# EAGLE design ItsyBitsy_Expander_v1.1 (EAGLE 9.2.2)
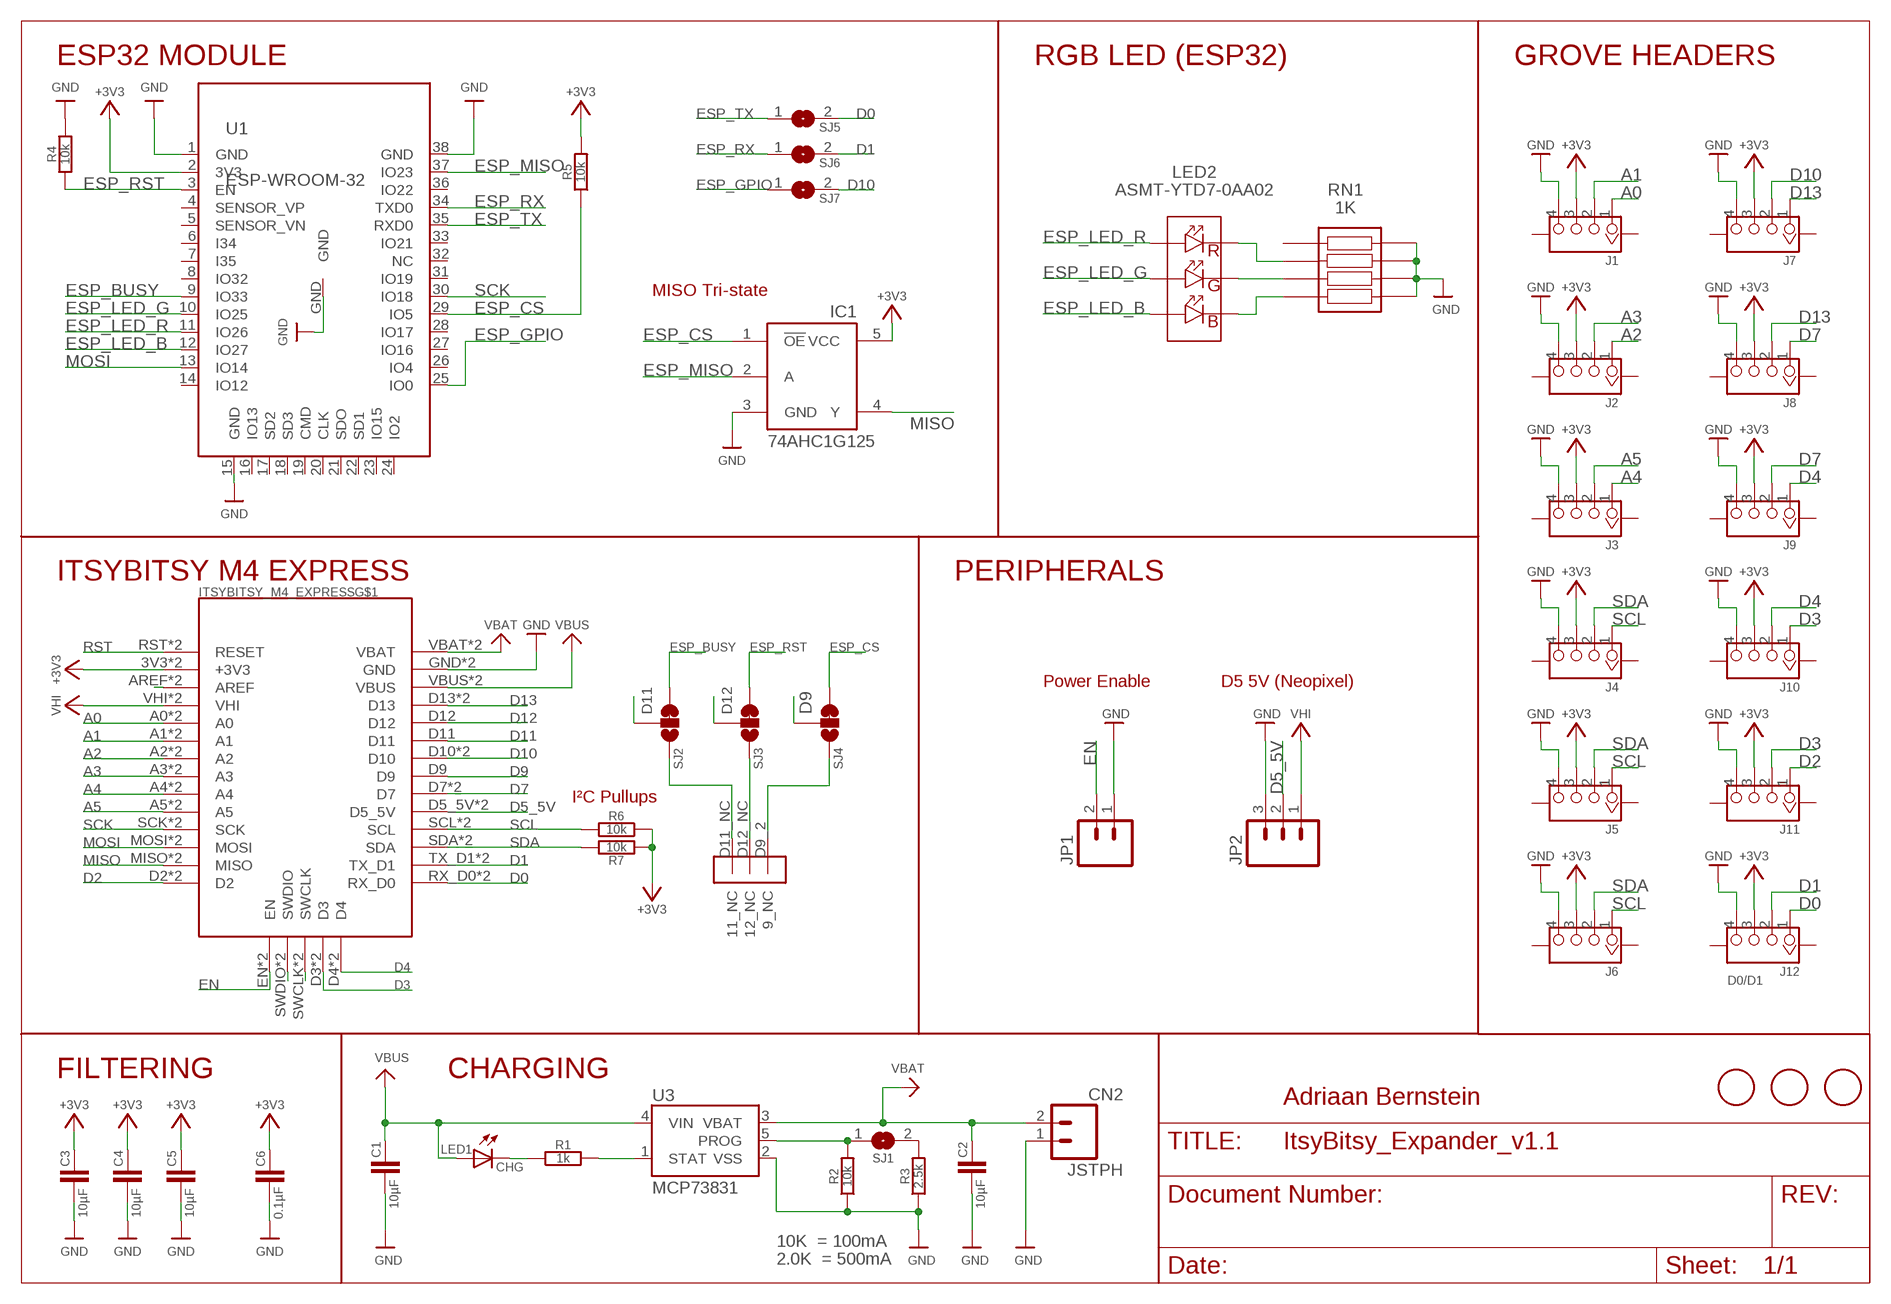
[diagram p0: schematic, sheet 1]

## Parts
C1  10µF  C-EUC0805  [C0805]
C2  10µF  C-EUC0805  [C0805]
C3  10µF  C-EUC0805  [C0805]
C4  10µF  C-EUC0805  [C0805]
C5  10µF  C-EUC0805  [C0805]
C6  0.1µF  C-EUC0603  [C0603]
CN2  JSTPH  M02-JST-2MM-SMT  [JST-2-SMD]
IC1  74AHC1G125  [SOT23-5L]
ITSYBITSY_M4_EXPRESS  ITSYBITSY_M4_NC  [ITSYBITSY_M4_MIXED_DOUBLEHEADERS_ALL_NC]
J1  H4P-SMD-2.0  GROVE-CONNECTOR-4PINHW4-PTH-2.0  [HW4-PTH-2.0]
J2  H4P-SMD-2.0  GROVE-CONNECTOR-4PINHW4-PTH-2.0  [HW4-PTH-2.0]
J3  H4P-SMD-2.0  GROVE-CONNECTOR-4PINHW4-PTH-2.0  [HW4-PTH-2.0]
J4  H4P-SMD-2.0  GROVE-CONNECTOR-4PINHW4-PTH-2.0  [HW4-PTH-2.0]
J5  H4P-SMD-2.0  GROVE-CONNECTOR-4PINHW4-PTH-2.0  [HW4-PTH-2.0]
J6  H4P-SMD-2.0  GROVE-CONNECTOR-4PINHW4-PTH-2.0  [HW4-PTH-2.0]
J7  H4P-SMD-2.0  GROVE-CONNECTOR-4PINHW4-PTH-2.0  [HW4-PTH-2.0]
J8  H4P-SMD-2.0  GROVE-CONNECTOR-4PINHW4-PTH-2.0  [HW4-PTH-2.0]
J9  H4P-SMD-2.0  GROVE-CONNECTOR-4PINHW4-PTH-2.0  [HW4-PTH-2.0]
J10  H4P-SMD-2.0  GROVE-CONNECTOR-4PINHW4-PTH-2.0  [HW4-PTH-2.0]
J11  H4P-SMD-2.0  GROVE-CONNECTOR-4PINHW4-PTH-2.0  [HW4-PTH-2.0]
J12  H4P-SMD-2.0  GROVE-CONNECTOR-4PINHW4-PTH-2.0  [HW4-PTH-2.0]
JP1  M02PTH  [1X02]
JP2  M03PTH  [1X03]
LED1  CHG  LEDCHIP-LED0603  [CHIP-LED0603]
LED2  ASMT-YTD7-0AA02  [ASMTYTD70AA02]
R1  1k  R-EU_R0603  [R0603]
R2  10k  R-EU_R0603  [R0603]
R3  2.5k  R-EU_R0603  [R0603]
R4  10k  R-EU_R0603  [R0603]
R5  10k  R-EU_R0603  [R0603]
R6  10k  R-EU_R0603  [R0603]
R7  10k  R-EU_R0603  [R0603]
RN1  1K  CAY16-221J4AS  [CAY1647R0F4LF]
SJ1  SJ  [SJ]
SJ5  SJ  [SJ]
SJ6  SJ  [SJ]
SJ7  SJ  [SJ]
SJ_D11  SJ2  SJ_2WAY_CLOSED  [SJ_2WAY_CLOSED]
SJ_D12  SJ3  SJ_2WAY_CLOSED  [SJ_2WAY_CLOSED]
SJ_D13  SJ4  SJ_2WAY_CLOSED  [SJ_2WAY_CLOSED]
U1  ESP-WROOM-32  [ESP-WROOM-32]
U3  MCP73831  [SOT23-5]
U$23  FIDUCIAL  [FIDUCIAL_1MM]
U$35  FIDUCIAL  [FIDUCIAL_1MM]
U$36  FIDUCIAL  [FIDUCIAL_1MM]

## Nets
2.5K: R3.2 SJ1.2
10K: R2.2 SJ1.1 U3.5(PROG)
+3V3: C3.1 C4.1 C5.1 C6.1 IC1.5(VCC) ITSYBITSY_M4_EXPRESS.3V3(+3V3) ITSYBITSY_M4_EXPRESS.3V3_2(+3V3) J1.3 J2.3 J3.3 J4.3 J5.3 J6.3 J7.3 J8.3 J9.3 J10.3 J11.3 J12.3 R5.2 R6.1 R7.1 U1.2(3V3)
+5V: ITSYBITSY_M4_EXPRESS.VHI ITSYBITSY_M4_EXPRESS.VHI_2(VHI) JP2.1 ; supply symbol labelled VHI
A0: ITSYBITSY_M4_EXPRESS.A0 ITSYBITSY_M4_EXPRESS.A0_2(A0) J1.1
A1: ITSYBITSY_M4_EXPRESS.A1 ITSYBITSY_M4_EXPRESS.A1_2(A1) J1.2
A2: ITSYBITSY_M4_EXPRESS.A2 ITSYBITSY_M4_EXPRESS.A2_2(A2) J2.1
A3: ITSYBITSY_M4_EXPRESS.A3 ITSYBITSY_M4_EXPRESS.A3_3(A3) J2.2
A4: ITSYBITSY_M4_EXPRESS.A4 ITSYBITSY_M4_EXPRESS.A4_2(A4) J3.1
A5: ITSYBITSY_M4_EXPRESS.A5 ITSYBITSY_M4_EXPRESS.A5_2(A5) J3.2
CHG: LED1.C R1.1
D0: ITSYBITSY_M4_EXPRESS.RX_D0 ITSYBITSY_M4_EXPRESS.RX_D0_2(RX_D0) J12.1 SJ5.2
D1: ITSYBITSY_M4_EXPRESS.TX_D1 ITSYBITSY_M4_EXPRESS.TX_D1_2(TX_D1) J12.2 SJ6.2
D2: ITSYBITSY_M4_EXPRESS.D2 ITSYBITSY_M4_EXPRESS.D2_2(D2) J11.1
D3: ITSYBITSY_M4_EXPRESS.D3 ITSYBITSY_M4_EXPRESS.D3_2(D3) J10.1 J11.2
D4: ITSYBITSY_M4_EXPRESS.D4 ITSYBITSY_M4_EXPRESS.D4_2(D4) J9.1 J10.2
D5_5V: ITSYBITSY_M4_EXPRESS.D5_5V ITSYBITSY_M4_EXPRESS.D5_5V_2(D5_5V) JP2.2
D7: ITSYBITSY_M4_EXPRESS.D7 ITSYBITSY_M4_EXPRESS.D7_2(D7) J8.1 J9.2
D9: ITSYBITSY_M4_EXPRESS.D9 SJ_D13.2
D9_NC: ITSYBITSY_M4_EXPRESS.D9_2(9_NC) SJ_D13.3
D10: ITSYBITSY_M4_EXPRESS.D10 ITSYBITSY_M4_EXPRESS.D10_2(D10) J7.2 SJ7.2
D11: ITSYBITSY_M4_EXPRESS.D11 SJ_D11.2
D11_NC: ITSYBITSY_M4_EXPRESS.D11_NC(11_NC) SJ_D11.3
D12: ITSYBITSY_M4_EXPRESS.D12 SJ_D12.2
D12_NC: ITSYBITSY_M4_EXPRESS.D12_NC(12_NC) SJ_D12.3
D13: ITSYBITSY_M4_EXPRESS.D13 ITSYBITSY_M4_EXPRESS.D13_NC(D13) J7.1 J8.2
EN: ITSYBITSY_M4_EXPRESS.EN ITSYBITSY_M4_EXPRESS.EN_2(EN) JP1.2
ESP_BUSY: SJ_D11.1 U1.9(IO33)
ESP_CS: IC1.1(!OE) R5.1 SJ_D13.1 U1.29(IO5)
ESP_GPIO: SJ7.1 U1.25(IO0)
ESP_LED_B: LED2.6(A_BLUE) U1.12(IO27)
ESP_LED_G: LED2.5(A_GREEN) U1.10(IO25)
ESP_LED_R: LED2.4(A_RED) U1.11(IO26)
ESP_MISO: IC1.2(A) U1.37(IO23)
ESP_RST: R4.1 SJ_D12.1 U1.3(EN)
ESP_RX: SJ6.1 U1.34(TXD0)
ESP_TX: SJ5.1 U1.35(RXD0)
GND: C1.2 C2.2 C3.2 C4.2 C5.2 C6.2 CN2.1 IC1.3(GND) ITSYBITSY_M4_EXPRESS.GND ITSYBITSY_M4_EXPRESS.GND_2(GND) J1.4 J2.4 J3.4 J4.4 J5.4 J6.4 J7.4 J8.4 J9.4 J10.4 J11.4 J12.4 JP1.1 JP2.3 R2.1 R3.1 R4.2 RN1.5(R4_2) RN1.6(R3_2) RN1.7(R2_2) RN1.8(R1_2) U1.1(GND) U1.15(GND) U1.38(GND) U1.GND U3.2(VSS)
MISO: IC1.4(Y) ITSYBITSY_M4_EXPRESS.MISO ITSYBITSY_M4_EXPRESS.MISO_2(MISO)
MOSI: ITSYBITSY_M4_EXPRESS.MOSI ITSYBITSY_M4_EXPRESS.MOSI_2(MOSI) U1.13(IO14)
N$1: LED2.2(K_GREEN) RN1.3(R3_1)
N$2: LED2.1(K_BLUE) RN1.4(R4_1)
N$3: LED2.3(K_RED) RN1.2(R2_1)
N$4: ITSYBITSY_M4_EXPRESS.AREF ITSYBITSY_M4_EXPRESS.AREF_2(AREF)
N$5: ITSYBITSY_M4_EXPRESS.SWDIO ITSYBITSY_M4_EXPRESS.SWDIO_2(SWDIO)
N$6: ITSYBITSY_M4_EXPRESS.SWCLK ITSYBITSY_M4_EXPRESS.SWCLK_2(SWCLK)
RST: ITSYBITSY_M4_EXPRESS.RST(RESET) ITSYBITSY_M4_EXPRESS.RST_2(RESET)
SCK: ITSYBITSY_M4_EXPRESS.SCK ITSYBITSY_M4_EXPRESS.SCK_2(SCK) U1.30(IO18)
SCL: ITSYBITSY_M4_EXPRESS.SCL ITSYBITSY_M4_EXPRESS.SCL_2(SCL) J4.1 J5.1 J6.1 R6.2
SDA: ITSYBITSY_M4_EXPRESS.SDA ITSYBITSY_M4_EXPRESS.SDA_2(SDA) J4.2 J5.2 J6.2 R7.2
STAT: R1.2 U3.1(STAT)
VBAT: C2.1 CN2.2 ITSYBITSY_M4_EXPRESS.VBAT ITSYBITSY_M4_EXPRESS.VBAT_2(VBAT) U3.3(VBAT)
VBUS: C1.1 ITSYBITSY_M4_EXPRESS.VBUS ITSYBITSY_M4_EXPRESS.VBUS_2(VBUS) LED1.A U3.4(VIN)
Unconnected: J1.5(SS1) J1.6(SS2) J2.5(SS1) J2.6(SS2) J3.5(SS1) J3.6(SS2) J4.5(SS1) J4.6(SS2) J5.5(SS1) J5.6(SS2) J6.5(SS1) J6.6(SS2) J7.5(SS1) J7.6(SS2) J8.5(SS1) J8.6(SS2) J9.5(SS1) J9.6(SS2) J10.5(SS1) J10.6(SS2) J11.5(SS1) J11.6(SS2) J12.5(SS1) J12.6(SS2) RN1.1(R1_1) U1.4(SENSOR_VP) U1.5(SENSOR_VN) U1.6(I34) U1.7(I35) U1.8(IO32) U1.14(IO12) U1.16(IO13) U1.17(SD2) U1.18(SD3) U1.19(CMD) U1.20(CLK) U1.21(SDO) U1.22(SD1) U1.23(IO15) U1.24(IO2) U1.26(IO4) U1.27(IO16) U1.28(IO17) U1.31(IO19) U1.32(NC) U1.33(IO21) U1.36(IO22)

## Notes on the sheet
- ESP32 MODULE | RGB LED (ESP32) | GROVE HEADERS
- MISO Tri-state
- ITSYBITSY M4 EXPRESS | PERIPHERALS
- Power Enable | D5 5V (Neopixel)
- I²C Pullups
- D0/D1
- FILTERING | CHARGING
- Adriaan Bernstein
- 10K  = 100mA
- 2.0K  = 500mA

## Library data of the parts
C1-C6 = ItsyBitsy_Expander_v1.1:C-EU: CAPACITOR, European symbol; SPICEPREFIX: C
CN2 JP1 = ItsyBitsy_Expander_v1.1:M02: Header 2 Standard 2-pin 0.1" header. Use with straight break away headers (SKU : PRT-00116), right angle break away headers (PRT-00553), swiss pins (PRT-00743), machine pins (PRT-00117), and female headers (PRT-00115). Molex polarized connector foot print use with SKU : PRT-08233 with associated crimp pins and housings.
IC1 = ItsyBitsy_Expander_v1.1:74AHC1G125
ITSYBITSY_M4_EXPRESS = ItsyBitsy_Expander_v1.1:ITSYBITSY_M4_NC
J1-J12 = ItsyBitsy_Expander_v1.1:GROVE-CONNECTOR-4PIN: 320110030
JP2 = ItsyBitsy_Expander_v1.1:M03: Header 3 Standard 3-pin 0.1" header. Use with straight break away headers (SKU : PRT-00116), right angle break away headers (PRT-00553), swiss pins (PRT-00743), machine pins (PRT-00117), and female headers (PRT-00115). Molex polarized connector foot print use with SKU : PRT-08232 with associated crimp pins and housings.
LED1 = ItsyBitsy_Expander_v1.1:LED: LED OSRAM: - CHIPLED LG R971, LG N971, LY N971, LG Q971, LY Q971, LO R971, LY R971 LH N974, LH R974 LS Q976, LO Q976, LY Q976 LO Q996 - Hyper CHIPLED LW Q18S LB Q993, LB Q99A, LB R99A - SideLED LS A670, LO A670, LY A670, LG A670, LP A670 LB A673, LV A673, LT A673, LW A673 LH A674 LY A675 LS A676, LA A676, LO A676, LY A676, LW A676 LS A679, LY A679, LG A679 - Hyper Micro SIDELED® LS Y876, LA Y876, LO Y876, LY Y876 LT Y87S - SmartLED LW L88C, LW L88S LB L89C, LB L89S, LG L890 LS L89K, LO L89K, LY L89K LS L896, LA L896, LO L896, LY L896 - TOPLED LS T670, LO T670, LY T670, LG T670, LP T670 LSG T670, LSP T670, LSY T670, LOP T670, LYG T670 LG T671, LOG T671, LSG T671 LB T673, LV T673, LT T673, LW T673 LH T674 LS T676, LA T676, LO T676, LY T676, LB T676, LH T676, LSB T676, LW T676 LB T67C, LV T67C, LT T67C, LS T67K, LO T67K, LY T67K, LW E67C LS E67B, LA E67B, LO E67B, LY E67B, LB E67C, LV E67C, LT E67C LW T67C LS T679, LY T679, LG T679 LS T770, LO T770, LY T770, LG T770, LP T770 LB T773, LV T773, LT T773, LW T773 LH T774 LS E675, LA E675, LY E675, LS T675 LS T776, LA T776, LO T776, LY T776, LB T776 LHGB T686 LT T68C, LB T68C - Hyper Mini TOPLED® LB M676 - Mini TOPLED Santana® LG M470 LS M47K, LO M47K, LY M47K Source: http://www.osram.convergy.de LUXEON: - LUMILED® LXK2-PW12-R00, LXK2-PW12-S00, LXK2-PW14-U00, LXK2-PW14-V00 LXK2-PM12-R00, LXK2-PM12-S00, LXK2-PM14-U00 LXK2-PE12-Q00, LXK2-PE12-R00, LXK2-PE12-S00, LXK2-PE14-T00, LXK2-PE14-U00 LXK2-PB12-K00, LXK2-PB12-L00, LXK2-PB12-M00, LXK2-PB14-N00, LXK2-PB14-P00, LXK2-PB14-Q00 LXK2-PR12-L00, LXK2-PR12-M00, LXK2-PR14-Q00, LXK2-PR14-R00 LXK2-PD12-Q00, LXK2-PD12-R00, LXK2-PD12-S00 LXK2-PH12-R00, LXK2-PH12-S00 LXK2-PL12-P00, LXK2-PL12-Q00, LXK2-PL12-R00 Source: www.luxeon.com KINGBRIGHT: KA-3528ASYC Source: www.kingbright.com
LED2 = ItsyBitsy_Expander_v1.1:ASMT-YTD7-0AA02: 2.1 V, 3.1 V Blue LED PLCC 6 SMD, Broadcom ASMT-YTD7-0AA02 Source: Datasheet <https://docs.broadcom.com/docs/AV02-3873EN>; DESCRIPTION: 2.1 V, 3.1 V Blue LED PLCC 6 SMD, Broadcom ASMT-YTD7-0AA02; HEIGHT: 1.8mm; MANUFACTURER_NAME: Avago Technologies; MANUFACTURER_PART_NUMBER: ASMT-YTD7-0AA02; MOUSER_PART_NUMBER: 630-ASMT-YTD7-0AA02; MOUSER_PRICE-STOCK: https://www.mouser.co.uk/ProductDetail/Broadcom-Avago/ASMT-YTD7-0AA02?qs=eJru1qh8zu7rRIK75I%2FMLw%3D%3D
R1-R7 = ItsyBitsy_Expander_v1.1:R-EU_: RESISTOR, European symbol; SPICEPREFIX: R
RN1 = ItsyBitsy_Expander_v1.1:CAY16-221J4AS: Resistor Networks & Arrays 220 OHMS 5% CONV 4RES Anti-Sulfur Source: Datasheet <https://www.bourns.com/docs/Product-Datasheets/CATCAY.pdf>; DESCRIPTION: Resistor Networks & Arrays 220 OHMS 5% CONV 4RES Anti-Sulfur; HEIGHT: 0.6mm; MANUFACTURER_NAME: Bourns; MANUFACTURER_PART_NUMBER: CAY16-221J4AS; MOUSER_PART_NUMBER: 652-CAY16-221J4AS; MOUSER_PRICE-STOCK: https://www.mouser.co.uk/ProductDetail/Bourns/CAY16-221J4AS?qs=5aG0NVq1C4yxlynUNdj32A%3D%3D
SJ1 SJ5-SJ7 = ItsyBitsy_Expander_v1.1:SJ
SJ_D11-SJ_D13 = ItsyBitsy_Expander_v1.1:SJ_2WAY_CLOSED
U1 = ItsyBitsy_Expander_v1.1:ESP-WROOM-32
U3 = ItsyBitsy_Expander_v1.1:MCP73831: Microchip's MCP73831 Miniature single cell, fully integrated Li-Ion, Li-polymer charge management controller http://ww1.microchip.com/downloads/en/DeviceDoc/21984a.pdf
U$23 U$35 U$36 = ItsyBitsy_Expander_v1.1:FIDUCIAL: For use by pick and place machines to calibrate the vision/machine, 1mm By microbuilder.eu

## Board
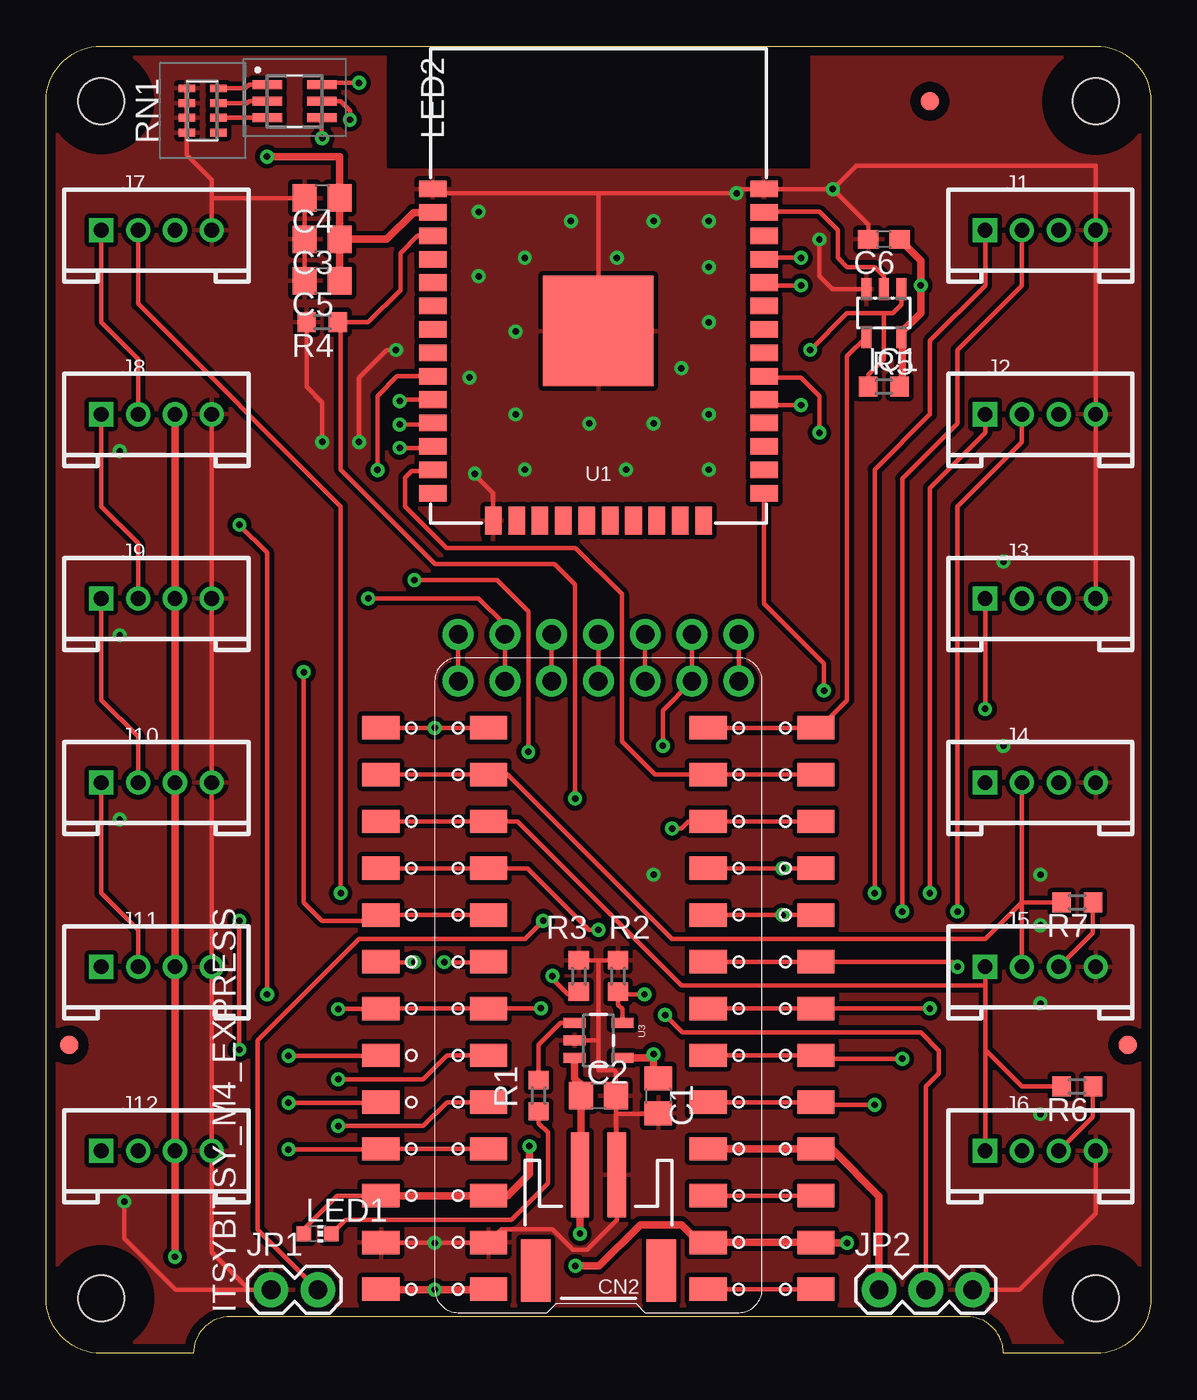
[diagram p1: board, top side]
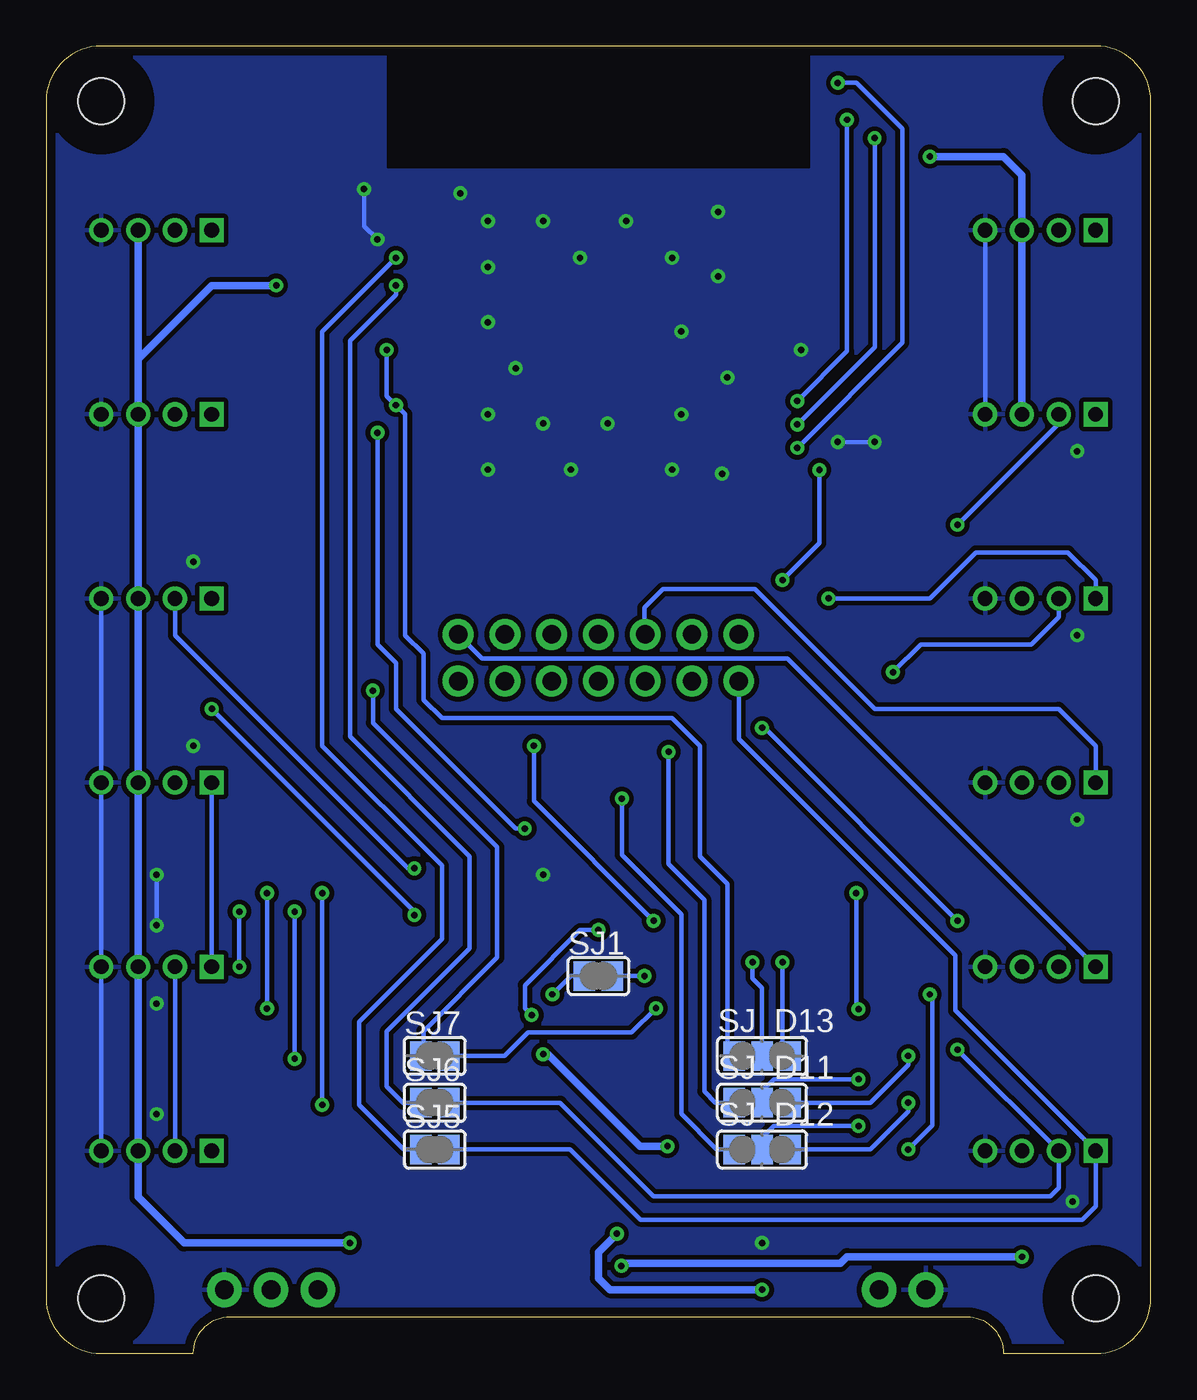
[diagram p2: board, bottom side, seen from below]

Size 60 x 71 mm. Coordinates in mm from the lower left corner, seen from the top.
Outline: 0,3 0,68 arc-90 3,71 57,71 arc-90 60,68 60,3 arc-90 57,0 52,0 arc90 50,2 10,2 arc90 8,0 3,0 arc-90 0,3
Copper layers (1*16): Top 0.035mm / dielectric 1.5mm / Bottom 0.035mm
Design rules "default *": minimum track width 6mil, minimum drill 0.35mm, track to track 10mil, track to pad 10mil, pad to pad 10mil, via to via 10mil, smd to smd 10mil, copper to edge 20mil, drill to drill 15mil, minimum pad ring 10mil, minimum via ring 8mil, stop-mask expansion 4mil, vias tented up to drill 14mil, thermal gap 10mil
Holes 2.5 mm at 3,3 57,3 57,68 3,68
tRestrict: area 54.2,65.2 to 59.8,70.8; area 0.2,65.2 to 5.8,70.8; area 0.2,0.2 to 5.8,5.8; area 54.2,0.2 to 59.8,5.8
bRestrict: area 0.2,65.2 to 5.8,70.8; area 0.2,0.2 to 5.8,5.8; area 54.2,0.2 to 59.8,5.8; area 54.2,65.2 to 59.8,70.8

### Footprints (pad centres in the part's own frame; a part is rotated, then mirrored left to right if it is on the bottom)
C0805 = smd 1.3 x 1.5: 1 -0.95,0; 2 0.95,0
C0603 = smd 1.1 x 1: 1 -0.85,0; 2 0.85,0
JST-2-SMD = smd 1 x 4.6: 1 -1,-3.7; 2 1,-3.7 | smd 1.6 x 3.4: NC1 -3.4,1.5; NC2 3.4,1.5
SOT23-5L = smd 0.55 x 1.2: 1 -0.95,-1.3; 2 0,-1.3; 3 0.95,-1.3; 4 0.95,1.3; 5 -0.95,1.3
ITSYBITSY_M4_MIXED_DOUBLEHEADERS_ALL_NC = smd 1.27 x 2.032: 3V3 -13.97,-5.969; 3V3_2 -13.97,-11.811; A0 -6.35,-5.969; A0_2 -6.35,-11.811; A1 -3.81,-5.969; A1_2 -3.81,-11.811; A2 -1.27,-5.969; A2_2 -1.27,-11.811; A3 1.27,-5.969; A3_3 1.27,-11.811; A4 3.81,-5.969; A4_2 3.81,-11.811; A5 6.35,-5.969; A5_2 6.35,-11.811; AREF -11.43,-5.969; AREF_2 -11.43,-11.811; D5_5V 6.35,5.969; D5_5V_2 6.35,11.811; D7 3.81,5.969; D7_2 3.81,11.811; D9 1.27,5.969; D9_2 1.27,11.811; D10 -1.27,5.969; D10_2 -1.27,11.811; D11 -3.81,5.969; D11_NC -3.81,11.811; D12 -6.35,5.969; D12_NC -6.35,11.811; D13 -8.89,5.969; D13_NC -8.89,11.811; GND -13.97,5.969; GND_2 -13.97,11.811; MISO 13.97,-5.969; MISO_2 13.97,-11.811; MOSI 11.43,-5.969; MOSI_2 11.43,-11.811; RST -16.51,-5.969; RST_2 -16.51,-11.811; SCK 8.89,-5.969; SCK_2 8.89,-11.811; SCL 8.89,5.969; SCL_2 8.89,11.811; SDA 11.43,5.969; SDA_2 11.43,11.811; TX_D1 13.97,5.969; TX_D1_2 13.97,11.811; VBAT -16.51,5.969; VBAT_2 -16.51,11.811; VBUS -11.43,5.969; VBUS_2 -11.43,11.811; VHI -8.89,-5.969; VHI_2 -8.89,-11.811 | drill 1 pad 1.676: D2 16.51,-7.62; D2_2 19.05,-7.62; D3 16.51,2.54; D3_2 19.05,2.54; D4 16.51,5.08; D4_2 19.05,5.08; EN 16.51,-5.08; EN_2 19.05,-5.08; RX_D0 16.51,7.62; RX_D0_2 19.05,7.62; SWCLK 16.51,0; SWCLK_2 19.05,0; SWDIO 16.51,-2.54; SWDIO_2 19.05,-2.54
HW4-PTH-2.0 = drill 0.8 pad 1.27 square: 1 -3,3.5 | drill 0.8 pad 1.27: 2 -1,3.5; 3 1,3.5; 4 3,3.5 | smd 0 x 0: 5 1.27,3.5; 6 0.635,3.5
1X02 = drill 1.016 pad 1.88: 1 0,0; 2 2.54,0
1X03 = drill 1.016 pad 1.88: 1 0,0; 2 2.54,0; 3 5.08,0
CHIP-LED0603 = smd 0.8 x 0.8: A 0,-0.75; C 0,0.75
ASMTYTD70AA02 = smd 0.5 x 1.6: 1 -0.9,-1.475; 2 0,-1.475; 3 0.9,-1.475; 4 0.9,1.475; 5 0,1.475; 6 -0.9,1.475
R0603 = smd 1 x 1.1: 1 -0.85,0; 2 0.85,0
CAY1647R0F4LF = smd 0.425 x 0.9: 1 -1.2,-0.85; 2 -0.4,-0.85; 3 0.4,-0.85; 4 1.2,-0.85; 5 1.2,0.85; 6 0.4,0.85; 7 -0.4,0.85; 8 -1.2,0.85
SJ = smd 1.168 x 1.6: 1 -0.762,0; 2 0.762,0
SJ_2WAY_CLOSED = smd 1.168 x 1.6: 1 -1.524,0; 2 0,0; 3 1.524,0
ESP-WROOM-32 = smd 0.9 x 1.5: 1 7.7,9; 2 6.43,9; 3 5.16,9; 4 3.89,9; 5 2.62,9; 6 1.35,9; 7 0.08,9; 8 -1.19,9; 9 -2.46,9; 10 -3.73,9; 11 -5,9; 12 -6.27,9; 13 -7.54,9; 14 -8.81,9; 25 -8.81,-9; 26 -7.54,-9; 27 -6.27,-9; 28 -5,-9; 29 -3.73,-9; 30 -2.46,-9; 31 -1.19,-9; 32 0.08,-9; 33 1.35,-9; 34 2.62,-9; 35 3.89,-9; 36 5.16,-9; 37 6.43,-9; 38 7.7,-9 | smd 1.5 x 0.9: 15 -10.3,5.715; 16 -10.3,4.445; 17 -10.3,3.175; 18 -10.3,1.905; 19 -10.3,0.635; 20 -10.3,-0.635; 21 -10.3,-1.905; 22 -10.3,-3.175; 23 -10.3,-4.445; 24 -10.3,-5.715 | smd 6 x 6: GND 0,0
SOT23-5 = smd 0.55 x 1.2: 1 -0.95,-1.3; 2 0,-1.3; 3 0.95,-1.3; 4 0.95,1.3; 5 -0.95,1.3
FIDUCIAL_1MM = smd 1 x 1: 1 0,0

### Placement (x,y rotation side)
C1  33.25,14 270 top
C2  30,14 0 top
C3  15,60.5 180 top
C4  15,62.75 180 top
C5  15,58.25 180 top
C6  45.5,60.5 180 top
CN2  30,6 180 top
IC1  45.5,56.5 180 top
ITSYBITSY_M4_EXPRESS  30,20 90 top
J1  54,57.5 0 top
J2  54,47.5 0 top
J3  54,37.5 0 top
J4  54,27.5 0 top
J5  54,17.5 0 top
J6  54,7.5 0 top
J7  6,57.5 0 top
J8  6,47.5 0 top
J9  6,37.5 0 top
J10  6,27.5 0 top
J11  6,17.5 0 top
J12  6,7.5 0 top
JP1  12.22,3.46 0 top
JP2  45.24,3.46 0 top
LED1  14.75,6.5 270 top
LED2  13.5,68 270 top
R1  26.75,14 90 top
R2  31.06,20.5 270 top
R3  28.94,20.5 270 top
R4  15,56 180 top
R5  45.5,52.5 0 top
R6  56,14.5 180 top
R7  56,24.5 180 top
RN1  8.5,67.5 90 top
SJ1  30,20.5 0 bottom
SJ5  38.89,11.08 0 bottom
SJ6  38.89,13.62 0 bottom
SJ7  38.89,16.16 0 bottom
SJ_D11  21.11,13.62 0 bottom
SJ_D12  21.11,11.08 0 bottom
SJ_D13  21.11,16.16 0 bottom
U1  30,55.53 90 top
U3  30,17 270 top
U$23  58.75,16.75 0 top
U$35  48,68 0 top
U$36  1.25,16.75 0 top

### Tracks (layer width: path | path; a pad name or v marks a point on that pad's centre or on a via)
2.5K  (via drill 0.35)
  Top 0.254: R3.2 28.79,19.5 28.34,19.5 27.5,20.34 v27.5,20.5
  Bottom 0.254: v27.5,20.5 SJ1.2
10K  (via drill 0.35)
  Top 0.254: v32.5,19.5 31.21,19.5 R2.2 31.06,18.94 31.3,18.7 U3.5
  Bottom 0.254: v32.5,19.5 31.5,20.5 SJ1.1
+3V3  (via drill 0.35)
  Top 0.254: J5.3 56.85,22.85 R7.1 | R6.1 56.85,12.85 J6.3
  Top 0.406: C3.1 C4.1 15.95,65 v12,65 | C3.1 C5.1 | C3.1 18.5,60.5 19.96,61.96 U1.2 | v28.75,4.75 30.02,4.75 32.27,7 34.5,7 35.47,6.03 ITSYBITSY_M4_EXPRESS.3V3 ITSYBITSY_M4_EXPRESS.3V3_2 41.84,6 v43.5,6 | C6.1 47.5,59.35 v47.5,58 47.5,56.5 46.45,55.45 IC1.5 46.5,55.15 46.5,52.65 R5.2 | v7,5.25 J12.3 J11.3 J10.3 J9.3 J8.3
  Bottom 0.406: v28.75,4.75 28.61,4.89 16.87,4.89 16.51,5.25 v7,5.25 | v12,65 8,65 7,64 J7.3 J8.3 | v43.5,6 52.5,6 55,8.5 J6.3 J5.3 J4.3 J3.3 J2.3 55,54 | v47.5,58 51,58 55,54 | 55,54 J1.3
+5V
  Top 0.406: ITSYBITSY_M4_EXPRESS.VHI ITSYBITSY_M4_EXPRESS.VHI_2 42.67,11.11 45.24,8.54 JP2.1
A0  (via drill 0.35)
  Top 0.254: v45,13.5 41.96,13.5 ITSYBITSY_M4_EXPRESS.A0_2 ITSYBITSY_M4_EXPRESS.A0 | v45,25 45,48 48,51 48,55 51,58 J1.1
  Bottom 0.254: v45,25 v45,13.5
A1  (via drill 0.35)
  Top 0.254: v46.5,16 42,16 ITSYBITSY_M4_EXPRESS.A1_2 ITSYBITSY_M4_EXPRESS.A1 | v46.5,24 46.5,47.5 49.5,50.5 49.5,54.5 53,58 J1.2
  Bottom 0.254: v46.5,24 v46.5,16
A2  (via drill 0.35)
  Top 0.254: ITSYBITSY_M4_EXPRESS.A2_2 41.83,18.75 42,18.75 41.98,18.73 ITSYBITSY_M4_EXPRESS.A2 v48,18.73 | J2.1 51,50 48,47 v48,25
  Bottom 0.254: v48,25 v48,18.73
A3  (via drill 0.35)
  Top 0.254: J2.2 53,49.5 49.5,46 v49.5,24 | ITSYBITSY_M4_EXPRESS.A3 ITSYBITSY_M4_EXPRESS.A3_3 49.23,21.27 v49.5,21
  Bottom 0.254: v49.5,21 v49.5,24
A4  (via drill 0.35)
  Top 0.254: ITSYBITSY_M4_EXPRESS.A4_2 v40,23.81 ITSYBITSY_M4_EXPRESS.A4 | v51,35 J3.1
  Bottom 0.254: v40,23.81 40,24 v51,35
A5  (via drill 0.35)
  Top 0.254: ITSYBITSY_M4_EXPRESS.A5_2 v40,26.35 ITSYBITSY_M4_EXPRESS.A5
  Bottom 0.254: v40,26.35 40.35,26.35 53,39 J3.2
CHG
  Top 0.254: R1.1 26.75,12.5 27.25,12 27.25,9.25 25.27,7.27 16.27,7.27 LED1.C
D0
  Top 0.254: ITSYBITSY_M4_EXPRESS.RX_D0_2 ITSYBITSY_M4_EXPRESS.RX_D0
  Bottom 0.254: SJ5.2 31.54,11.08 27.73,7.27 3.73,7.27 3,8 J12.1 10.62,18.62 10.62,21.62 22.38,33.38 ITSYBITSY_M4_EXPRESS.RX_D0
D1  (via drill 0.35)
  Top 0.254: ITSYBITSY_M4_EXPRESS.TX_D1 v21.11,33.97 ITSYBITSY_M4_EXPRESS.TX_D1_2 | v10.5,23.5 v10.5,16.5
  Bottom 0.254: v21.11,33.97 20.97,33.97 v10.5,23.5 | SJ6.2 32.08,13.62 27,8.54 5.46,8.54 5,9 J12.2 v10.5,16.5
D2
  Top 0.254: ITSYBITSY_M4_EXPRESS.D2_2 ITSYBITSY_M4_EXPRESS.D2
  Bottom 0.254: ITSYBITSY_M4_EXPRESS.D2_2 36.32,37.75 19.75,37.75 J11.1
D3
  Top 0.254: ITSYBITSY_M4_EXPRESS.D3_2 ITSYBITSY_M4_EXPRESS.D3 | J10.1 3,25 5,23 J11.2
  Bottom 0.254: ITSYBITSY_M4_EXPRESS.D3_2 27.5,39.09 27.5,40.5 26.5,41.5 21.5,41.5 15,35 5,35 3,33 J10.1
D4  (via drill 0.35)
  Top 0.254: ITSYBITSY_M4_EXPRESS.D4 ITSYBITSY_M4_EXPRESS.D4_2 24.92,39.58 23.5,41 v17.5,41 | J9.1 3,35.5 5,33.5 J10.2
  Bottom 0.254: J9.1 3,42 4.5,43.5 9.5,43.5 12,41 v17.5,41
D5_5V  (via drill 0.35)
  Top 0.254: ITSYBITSY_M4_EXPRESS.D5_5V_2 ITSYBITSY_M4_EXPRESS.D5_5V 26.15,26.35 29.5,23 v30,23 | JP2.2 47.78,14.5 48.5,15.22 48.5,16.44 47.51,17.43 34.57,17.43 v33.62,18.38
  Bottom 0.254: v33.62,18.38 34,18.75 34,20 31,23 v30,23
D7  (via drill 0.35)
  Top 0.254: ITSYBITSY_M4_EXPRESS.D7 ITSYBITSY_M4_EXPRESS.D7_2 17.81,23.81 17.5,23.5 15,23.5 14,24.5 v14,37 | J8.1 3,46 5,44 J9.2
  Bottom 0.254: v14,37 12.5,38.5 6.5,38.5 5,40 J9.2
D9  (via drill 0.35)
  Top 0.254: ITSYBITSY_M4_EXPRESS.D9 24.01,21.25 v21.62,21.25
  Bottom 0.254: v21.62,21.25 21.62,20.38 21.11,19.86 SJ_D13.2
D9_NC  (via drill 0.35)
  Top 0.254: ITSYBITSY_M4_EXPRESS.D9_2 18.21,21.25 v20,21.25
  Bottom 0.254: v20,21.25 20,16.5 19.66,16.16 SJ_D13.3
D10  (via drill 0.35)
  Top 0.254: v15.87,18.7 18.16,18.7 ITSYBITSY_M4_EXPRESS.D10_2 ITSYBITSY_M4_EXPRESS.D10 26.86,18.73 v26.88,18.75 | J7.2 5,57 16,46 v16,25
  Bottom 0.254: v26.88,18.75 28.2,17.43 33.82,17.43 35.09,16.16 SJ7.2 | v16,25 16,18.83 v15.87,18.7
D11  (via drill 0.35)
  Top 0.254: v15.87,14.89 20.48,14.89 21.77,16.19 ITSYBITSY_M4_EXPRESS.D11
  Bottom 0.254: SJ_D11.2 21.11,14.26 20.48,14.89 v15.87,14.89
D11_NC  (via drill 0.35)
  Top 0.254: v13.17,16.16 18.16,16.16 ITSYBITSY_M4_EXPRESS.D11_NC
  Bottom 0.254: v13.17,16.16 13.17,15.68 15.24,13.62 SJ_D11.3
D12  (via drill 0.35)
  Top 0.254: v15.87,12.35 20.48,12.35 21.77,13.65 ITSYBITSY_M4_EXPRESS.D12
  Bottom 0.254: SJ_D12.2 21.11,11.71 20.48,12.35 v15.87,12.35
D12_NC  (via drill 0.35)
  Top 0.152: ITSYBITSY_M4_EXPRESS.D12_NC 18.16,13.62
  Top 0.254: 18.16,13.62 v13.17,13.62
  Bottom 0.254: SJ_D12.3 15.24,11.08 13.17,13.14 v13.17,13.62
D13  (via drill 0.35)
  Top 0.254: J7.1 3,56 5,54 J8.2 | ITSYBITSY_M4_EXPRESS.D13 ITSYBITSY_M4_EXPRESS.D13_NC 18.16,11.08 v13.17,11.08 | v10.5,45 12,43.5 v12,19.5
  Bottom 0.254: v13.17,11.08 11.88,12.38 11.88,19.38 v12,19.5 | J8.2 5,50.5 v10.5,45
EN  (via drill 0.35)
  Top 0.254: ITSYBITSY_M4_EXPRESS.EN_2 ITSYBITSY_M4_EXPRESS.EN 33.5,34.93 v33.5,33 | JP1.2 11.5,6.72 11.5,17 17.01,22.51 26.01,22.51 v27,23.5
  Bottom 0.254: v33.5,33 33.5,30 v27,23.5
ESP_BUSY  (via drill 0.35)
  Top 0.254: v26.19,32.67 26.19,40.29 24.48,42 v20,42 | U1.9 19.07,53.07 18,52 v18,47.98
  Bottom 0.254: v26.19,32.67 26.19,26.57 24.25,24.64 24.25,14.24 23.63,13.62 SJ_D11.1 | v20,42 18,44 v18,47.98
ESP_CS  (via drill 0.35)
  Top 0.254: U1.29 39.3,51.5 v41,51.5 | IC1.1 46.45,56.95 46,56.5 45.5,56.5 | v41.5,54.5 43.5,56.5 45.5,56.5 | 45.5,56.5 45.5,54 44.65,53.15 R5.1
  Bottom 0.254: v41.5,54.5 41.5,52 v41,51.5 40.5,51 40.5,39 39.5,38 39.5,35.5 38.5,34.5 26,34.5 24.5,33 24.5,27 23,25.5 23,16.53 SJ_D13.1
ESP_GPIO  (via drill 0.35)
  Top 0.254: U1.25 39,40.72 42.25,37.47 v42.25,36
  Bottom 0.254: v42.25,36 42.25,34.25 35.5,27.5 35.5,21.5 39.5,17.5 39.5,16.31 SJ7.1
ESP_LED_B  (via drill 0.35)
  Top 0.254: LED2.6 15.07,69 v17,69 | U1.12 20.92,49.18 v19.2,49.18
  Bottom 0.254: v19.2,49.18 13.5,54.88 13.5,66.5 16,69 v17,69
ESP_LED_G  (via drill 0.35)
  Top 0.254: v16.5,67 16.5,67.5 16,68 LED2.5 | U1.10 19.29,51.8 v19.2,51.72
  Bottom 0.254: v19.2,51.72 16.5,54.42 v16.5,67
ESP_LED_R  (via drill 0.35)
  Top 0.254: LED2.4 14.97,66 v15,66 | U1.11 20.92,50.45 v19.2,50.45
  Bottom 0.254: v15,66 15,54.66 v19.2,50.45
ESP_MISO
  Top 0.254: U1.37 39.04,62 42,62 43,61 43,59.5 43.5,59 45,59 45.5,58.5 IC1.2
ESP_RST  (via drill 0.35)
  Top 0.254: U1.3 20.19,60.69 19.25,59.75 19.25,57.75 17.5,56 R4.1 16,55.85 16,48 21.12,42.88 27.62,42.88 28.73,41.77 v28.73,30.13
  Bottom 0.254: SJ_D12.1 23.58,11.08 25.5,13 25.5,23.84 28.73,27.07 v28.73,30.13
ESP_RX  (via drill 0.35)
  Top 0.254: v41,58 39.15,58 U1.34
  Bottom 0.254: SJ6.1 40.62,13.62 41.5,14.5 41.5,17.5 37,22 37,27 43.5,33.5 43.5,55 41,57.5 v41,58
ESP_TX  (via drill 0.35)
  Top 0.254: v41,59.5 39.08,59.5 U1.35
  Bottom 0.254: SJ5.1 40.58,11.08 43,13.5 43,18 38.5,22.5 38.5,26.5 45,33 45,55.5 v41,59.5
GND  (via drill 0.35)
  Top 0.254: v42.73,63.23 U1.38 37.73,63.23 v37.5,63 30,63 | ITSYBITSY_M4_EXPRESS.GND_2 18.22,6 v21.11,6 24,6 ITSYBITSY_M4_EXPRESS.GND 24.74,6.74 25.46,6.74 25.47,6.75 27.5,6.75 28.62,5.62 29.38,5.62 31,7.25 CN2.1 30.85,9.85 30.95,9.95 30.95,13.05 | U3.2 30,17 | R3.1 30,21.35 | 30,21.35 R2.1 | 30,21.35 30,17 | v42.73,63.23 44,64.5 57,64.5 J1.4 J2.4 J3.4 | C6.2 44.65,61.31 v42.73,63.23 | C5.2 C3.2 C4.2 9,62.75 J7.4 9,63.75 7.65,65.1 RN1.8 RN1.7 RN1.6 RN1.5 | v23.29,47.77 23.29,47.73 24.29,46.73 U1.15 | JP2.3 52.86,3.46 57,7.6 J6.4 | 30.95,13.05 31,13 33.2,13 C1.2 | 30.95,13.05 C2.2 30.95,15.3 30.88,15.38 30,15.38 30,17 | U1.GND 30,63 | 30,63 21.23,63 U1.1 | v19,54.5 18.5,54.5 17,53 v17,49.5 | R4.2 14.15,52.5 15,51.65 v15,49.5 | 11.04,3.46 JP1.1 | 11.04,3.46 9,5.5 J12.4 J11.4 J10.4 J9.4 J8.4 | v4.25,8.25 4.25,6.25 7.04,3.46 11.04,3.46 | IC1.3 42.7,57.8 42,58.5 v42,60.5
  Bottom 0.254: v17,49.5 v15,49.5 | J7.4 J8.4 | J3.4 J4.4 J5.4 J6.4 | v54,23.25 v54,26 | v42,60.5 42.73,61.23 v42.73,63.23
  other vias: 23,53 26,48 25.5,51 29.5,50.5 33,50.5 31.5,48 36,48 36,51 34.5,53.5 36,56 36,59 36,61.5 25.5,55.5 23.5,58.5 31,59.5 26,59.5 33,61.5 23.5,62 28.5,61.5 33,26 4,49 4,39 4,29 52,33 52,43 54,19 54,13
  pour Bottom: -2,72 62,72 62,-2 -2,-2
  pour Top: -1,73 -1,-1 61,-1 61,73
MISO
  Top 0.254: ITSYBITSY_M4_EXPRESS.MISO ITSYBITSY_M4_EXPRESS.MISO_2 42,33.97 43.5,35.47 43.5,54.15 IC1.4
MOSI
  Top 0.254: U1.13 20.92,47.91 19.84,47.91 19.5,47.57 19.5,46 21.75,43.75 28.75,43.75 31.27,41.23 31.27,33.23 33.07,31.43 ITSYBITSY_M4_EXPRESS.MOSI ITSYBITSY_M4_EXPRESS.MOSI_2
N$1
  Top 0.254: RN1.3 10.93,67.9 11.02,68 LED2.2
N$2
  Top 0.254: RN1.4 10.82,68.7 11.02,68.9 LED2.1
N$3
  Top 0.254: LED2.3 11.93,67 11.82,67.1 RN1.2
N$4
  Top 0.254: ITSYBITSY_M4_EXPRESS.AREF ITSYBITSY_M4_EXPRESS.AREF_2
N$5
  Top 0.254: ITSYBITSY_M4_EXPRESS.SWDIO ITSYBITSY_M4_EXPRESS.SWDIO_2
N$6
  Top 0.254: ITSYBITSY_M4_EXPRESS.SWCLK ITSYBITSY_M4_EXPRESS.SWCLK_2
RST
  Top 0.254: ITSYBITSY_M4_EXPRESS.RST_2 ITSYBITSY_M4_EXPRESS.RST
SCK  (via drill 0.35)
  Top 0.254: ITSYBITSY_M4_EXPRESS.SCK_2 ITSYBITSY_M4_EXPRESS.SCK 34.89,28.89 34.5,28.5 v34,28.5 | U1.30 39.07,53 41,53 42,52 v42,50
  Bottom 0.254: v34,28.5 34.5,28.5 41,35 41,37.5 42,38.5 v42,50
SCL
  Top 0.254: 51,20 34.5,20 25.61,28.89 ITSYBITSY_M4_EXPRESS.SCL ITSYBITSY_M4_EXPRESS.SCL_2 | R6.2 53,14.5 51,16.5 | J5.1 51,20 | 51,20 51,16.5 | 51,16.5 J6.1
  Bottom 0.254: J4.1 J5.1
SDA
  Top 0.254: ITSYBITSY_M4_EXPRESS.SDA_2 ITSYBITSY_M4_EXPRESS.SDA 25.07,31.43 34,22.5 51,22.5 53,24.5 | J4.2 53,24.5 | 53,24.5 J5.2 | 53,24.5 R7.2
  Bottom 0.254: J6.2 J5.2
STAT
  Top 0.254: R1.2 26.75,16.75 27.95,17.95 U3.1
VBAT  (via drill 0.35)
  Top 0.406: U3.3 28.7,14.95 29.15,14.5 C2.1 29.05,9.75 CN2.2 v29,6.5 | ITSYBITSY_M4_EXPRESS.VBAT_2 18.22,3.46 v21.11,3.46 24,3.46 ITSYBITSY_M4_EXPRESS.VBAT
  Bottom 0.406: v21.11,3.46 29.36,3.46 30,4.09 30,5.5 v29,6.5
VBUS  (via drill 0.35)
  Top 0.254: ITSYBITSY_M4_EXPRESS.VBUS_2 15.82,8.57 14,6.75 LED1.A
  Top 0.406: v26.25,11.25 26.25,9.75 25.07,8.57 ITSYBITSY_M4_EXPRESS.VBUS ITSYBITSY_M4_EXPRESS.VBUS_2 | U3.4 32.8,16.05 v33,16.25 33,15.2 C1.1
  Bottom 0.406: v33,16.25 32.75,16.25 27.75,11.25 v26.25,11.25